# EAGLE design v2_pogo (EAGLE 9.6.1)
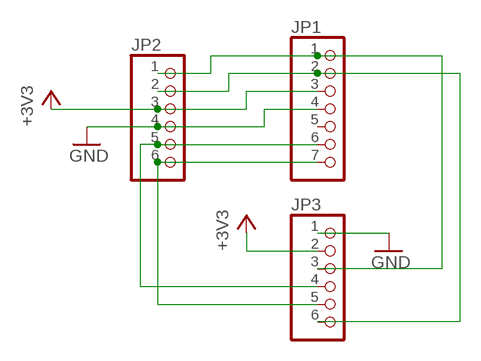
[diagram p0: schematic, sheet 1]

## Parts
JP1  PINHD-1X7  [1X07]
JP2  PINHD-1X6  [1X06]
JP3  PINHD-1X6  [1X06]

## Nets
+3V3: JP1.3 JP2.3 JP3.2
GND: JP1.4 JP2.4 JP3.1
N$1: JP1.7 JP2.6 JP3.5
N$2: JP1.6 JP2.5 JP3.4
N$5: JP1.2 JP2.2 JP3.6
N$6: JP1.1 JP2.1 JP3.3
Unconnected: JP1.5

## Library data of the parts
JP1 = pinhead:PINHD-1X7: PIN HEADER
JP2 JP3 = pinhead:PINHD-1X6: PIN HEADER

## Board
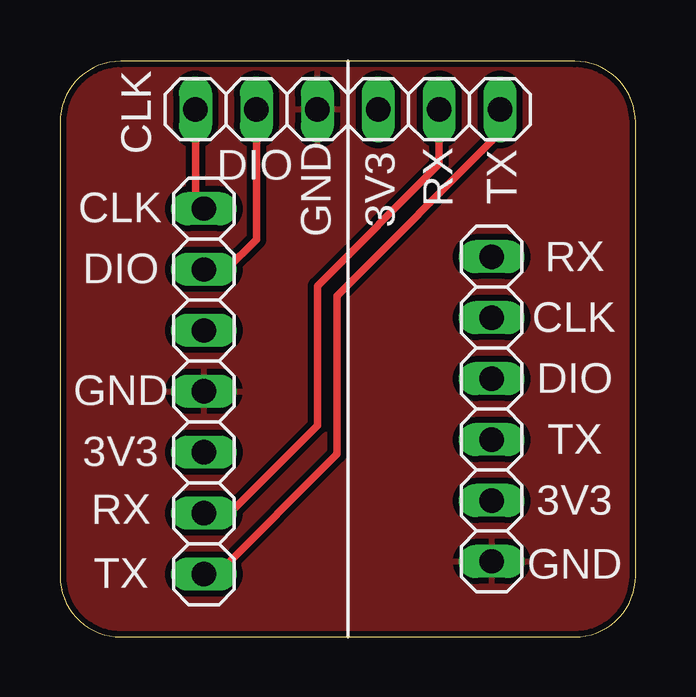
[diagram p1: board, top side]
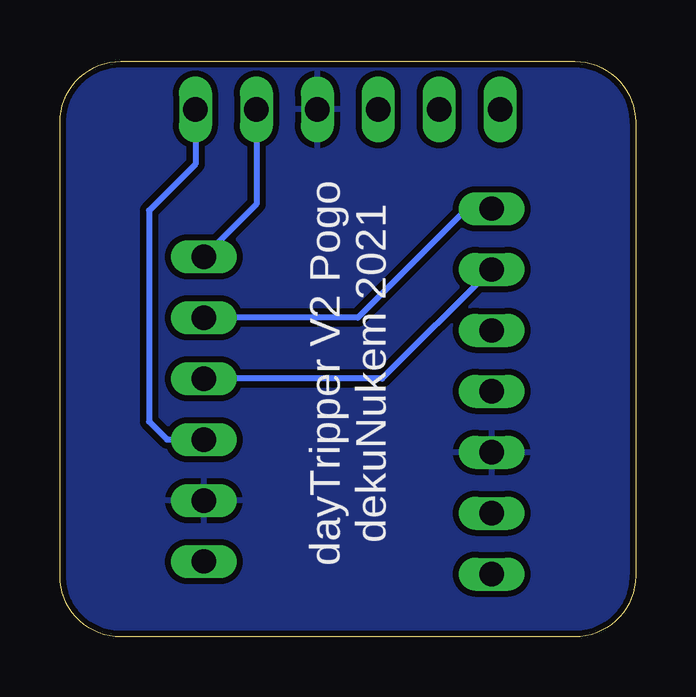
[diagram p2: board, bottom side, seen from below]

Size 24 x 24 mm. Coordinates in mm from the lower left corner, seen from the top.
Outline: 0,21.46 0,2.54 arc90 2.54,0 21.46,0 arc90 24,2.54 24,21.46 arc90 21.46,24 2.54,24 arc90 0,21.46
Copper layers (1*16): Top 0.035mm / dielectric 1.5mm / Bottom 0.035mm
Design rules "deku_2layer_6mil *": minimum track width 6mil, minimum drill 15mil, track to track 6mil, track to pad 6mil, pad to pad 6mil, via to via 6mil, smd to smd 6mil, copper to edge 10mil, drill to drill 6mil, minimum pad ring 7mil, minimum via ring 7mil, stop-mask expansion 4mil, vias tented up to drill 25mil, thermal gap 10mil

### Footprints (pad centres in the part's own frame; a part is rotated, then mirrored left to right if it is on the bottom)
1X07 = drill 1.016 long: 1 -7.62,0; 2 -5.08,0; 3 -2.54,0; 4 0,0; 5 2.54,0; 6 5.08,0; 7 7.62,0
1X06 = drill 1.016 long: 1 -6.35,0; 2 -3.81,0; 3 -1.27,0; 4 1.27,0; 5 3.81,0; 6 6.35,0

### Placement (x,y rotation side)
JP1  6,10.24 90 top
JP2  12,22 180 top
JP3  18,9.5 90 top

### Tracks (layer width: path | path; a pad name or v marks a point on that pad's centre or on a via)
+3V3
  pour Bottom (isolate 0.254): 0,21.46 0,2.54 arc90 2.54,0 21.46,0 arc90 24,2.54 24,21.46 arc90 21.46,24 2.54,24 arc90
GND
  pour Top (isolate 0.254): 0,21.46 0,2.54 arc90 2.54,0 21.46,0 arc90 24,2.54 24,21.46 arc90 21.46,24 2.54,24 arc90
N$1
  Top 0.305: JP2.6 5.65,18.21 JP1.7
  Bottom 0.254: JP1.7 7.03,17.86 11.58,13.31 JP3.5
N$2
  Top 0.305: JP2.5 8.19,16.57 6.94,15.32 JP1.6
  Bottom 0.254: JP1.6 6.02,15.32 10.57,10.77 JP3.4
N$5
  Top 0.305: JP2.2 15.81,19.71 10.73,14.63 10.73,8.82 7.06,5.16 JP1.2
  Bottom 0.254: JP2.2 15.81,18.04 JP3.6
N$6
  Top 0.305: JP2.1 18.35,21.02 11.56,14.22 11.56,7.62 6.55,2.62 JP1.1
  Bottom 0.254: JP2.1 18.35,19.71 20.28,17.78 20.28,8.98 19.53,8.23 JP3.3

### Text on the board
tNames: CLK | DIO | GND | 3V3 | RX | TX | CLK | RX | DIO | CLK | DIO | GND | 3V3 | TX | 3V3 | RX | TX | GND
bNames: dayTripper V2 Pogo / dekuNukem 2021